# EAGLE schematic Impedance (EAGLE 9.6.2)
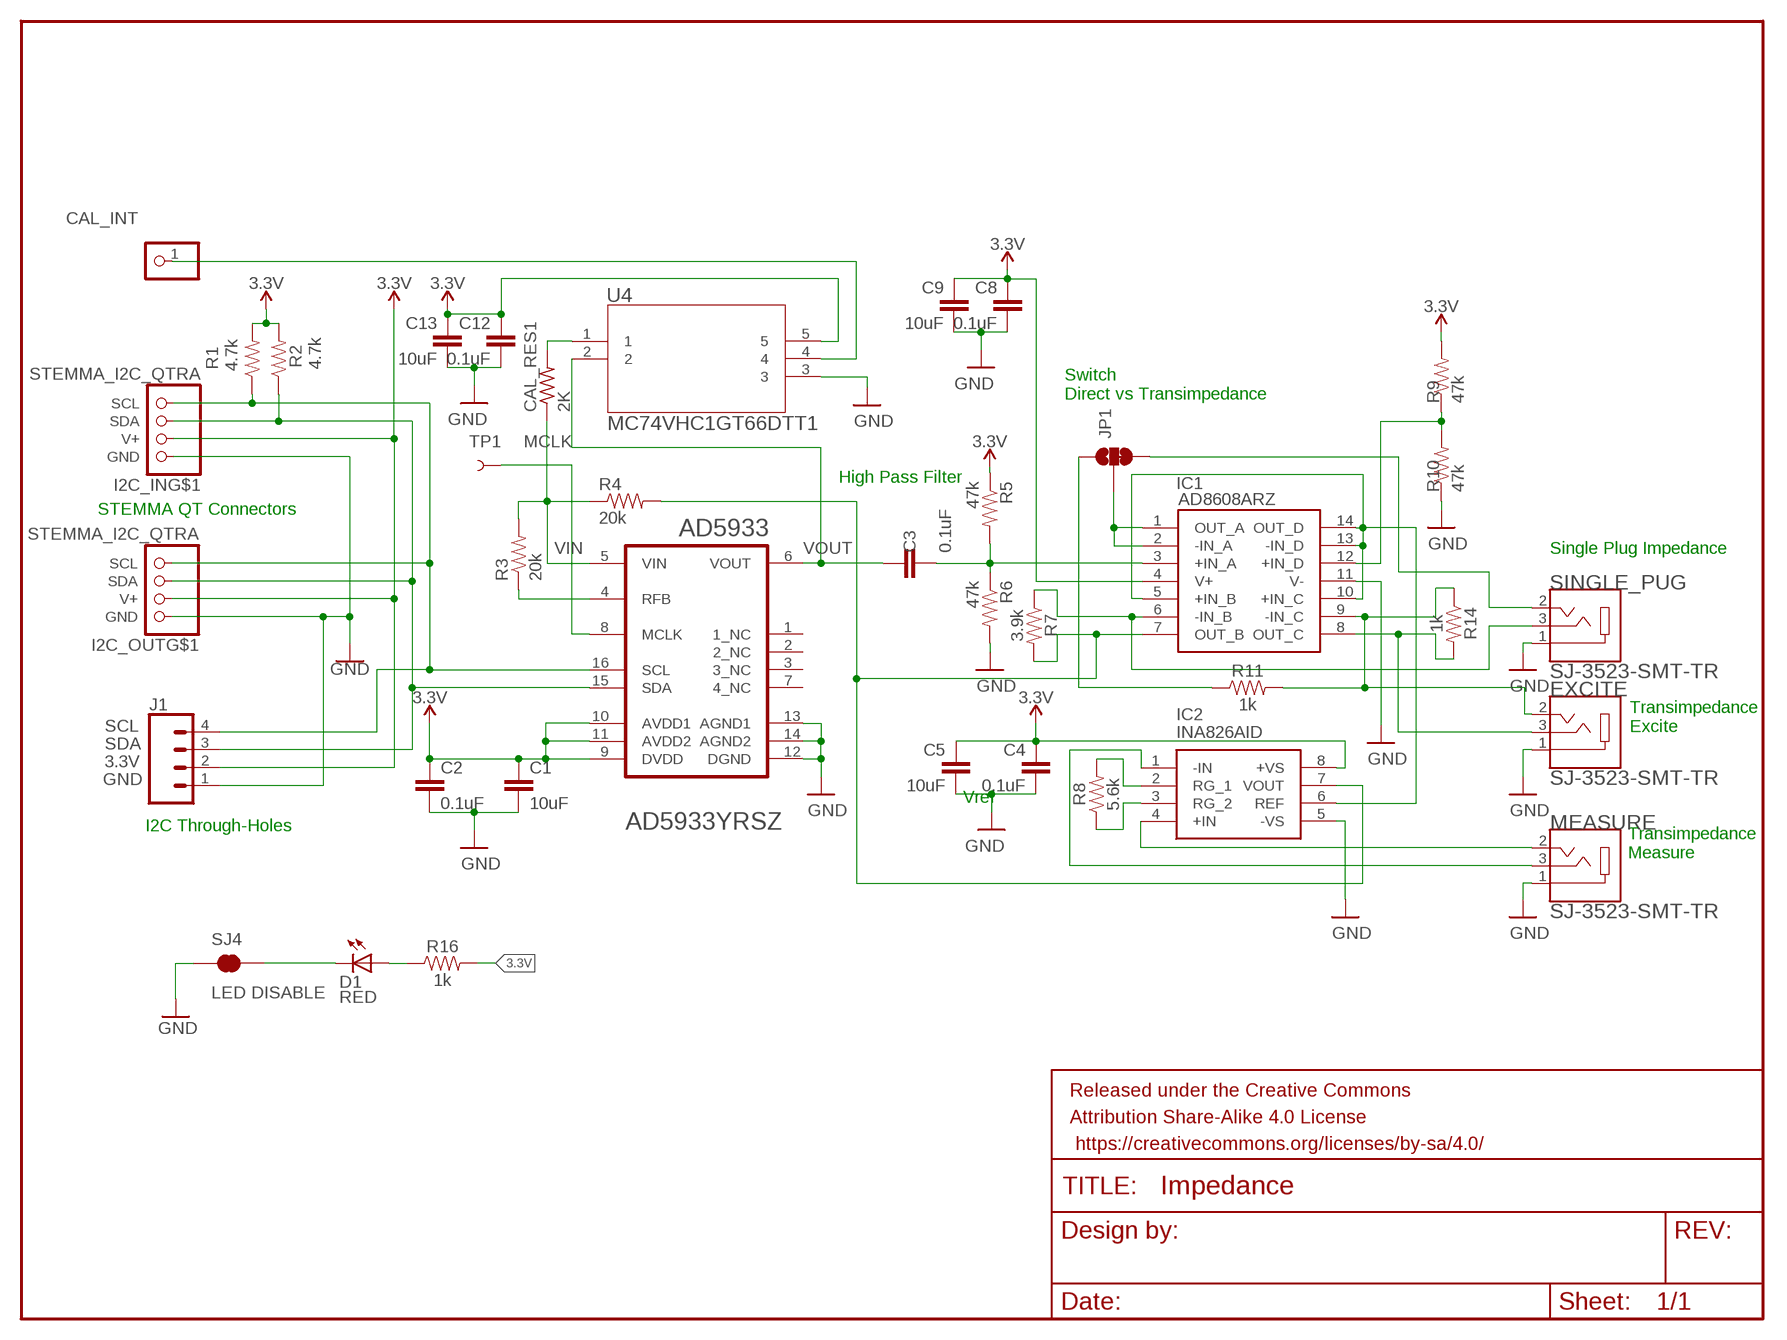
[diagram p0: schematic, sheet 1]

## Parts
AD5933  ANALOG_DEVICES_AD5933YRSZANALOG_DEVICES_AD5933YRSZ_0_0  [ANALOG_DEVICES_AD5933YRSZ_0]
C1  10uF  C-EUC0603  [C0603]
C2  0.1uF  C-EUC0603  [C0603]
C3  0.1uF  0.1UF-0603-25V-(+80/-20%)  [0603]
C4  0.1uF  C-EUC0603  [C0603]
C5  10uF  C-EUC0603  [C0603]
C8  0.1uF  C-EUC0603  [C0603]
C9  10uF  C-EUC0603  [C0603]
C12  0.1uF  C-EUC0603  [C0603]
C13  10uF  C-EUC0603  [C0603]
CAL_INT  PINHD-1X1  [1X01]
CAL_RES1  2K  R-US_R0603  [R0603]
D1  RED  LED-RED0603  [LED-0603]
EXCITE  SJ-3523-SMT-TR  [CUI_SJ-3523-SMT-TR]
FRAME1  FRAME-LETTERNO_PACKAGE  [DUMMY]
I2C_IN  STEMMA_I2C_QTRA  [JST_SH4_RA]
I2C_OUT  STEMMA_I2C_QTRA  [JST_SH4_RA]
IC1  AD8608ARZ  [SOIC127P600X175-14N]
IC2  INA826AID  [SOIC127P600X175-8N]
J1  CONN_04  [1X04]
JP1  JUMPER-SMT_3_1-NC_TRACE_NO-SILK  [SMT-JUMPER_3_1-NC_TRACE_NO-SILK]
MEASURE  SJ-3523-SMT-TR  [CUI_SJ-3523-SMT-TR]
R1  4.7k  4.7KOHM-0603-1/10W-1%  [0603]
R2  4.7k  4.7KOHM-0603-1/10W-1%  [0603]
R3  20k  20KOHM-0603-1/10W-1%  [0603]
R4  20k  20KOHM-0603-1/10W-1%  [0603]
R5  47k  47KOHM-0603-1/10W-1%  [0603]
R6  47k  47KOHM-0603-1/10W-1%  [0603]
R7  3.9k  3.9KOHM-0603-1/10W-1%  [0603]
R8  5.6k  5.6KOHM-0603-1/10W-1%  [0603]
R9  47k  47KOHM-0603-1/10W-1%  [0603]
R10  47k  47KOHM-0603-1/10W-1%  [0603]
R11  1k  1KOHM-0603-1/10W-1%  [0603]
R14  1k  1KOHM-0603-1/10W-1%  [0603]
R16  1k  1KOHM-0603-1/10W-1%  [0603]
SINGLE_PUG  SJ-3523-SMT-TR  [CUI_SJ-3523-SMT-TR]
SJ4  LED DISABLE  JUMPER-SMT_2_NC_TRACE_NO-SILK  [SMT-JUMPER_2_NC_TRACE_NO-SILK]
TP1  TEST-POINT3X5  [PAD.03X.05]
U4  MC74VHC1GT66DTT1  [TSOP5_1P65X3P15_ONS]

## Nets
3.3V: AD5933.9(DVDD) AD5933.10(AVDD1) AD5933.11(AVDD2) C1.1 C2.1 C4.1 C5.1 C8.1 C9.1 C12.1 C13.1 I2C_IN.2(V+) I2C_OUT.2(V+) IC1.4(V+) IC2.8(+VS) J1.2 R1.2 R2.2 R5.1 R9.2 R16.2 U4.5
GND: AD5933.12(DGND) AD5933.13(AGND1) AD5933.14(AGND2) C1.2 C2.2 C4.2 C5.2 C8.2 C9.2 C12.2 C13.2 EXCITE.1 I2C_IN.1(GND) I2C_OUT.1(GND) IC1.11(V-) IC2.5(-VS) J1.1 MEASURE.1 R6.2 R10.1 SINGLE_PUG.1 SJ4.1 U4.3
MCLK: AD5933.8(MCLK) TP1.P$1
N$1: IC1.6(-IN_B) R7.1 SINGLE_PUG.3
N$2: CAL_INT.1 U4.4
N$5: AD5933.4(RFB) R3.1
N$6: C3.2 IC1.3(+IN_A) R5.2 R6.1
N$8: JP1.1 R11.1
N$9: IC1.1(OUT_A) IC1.2(-IN_A) JP1.2
N$13: IC1.7(OUT_B) IC2.7(VOUT) R4.2 R7.2
N$14: IC1.12(+IN_D) R9.1 R10.2
N$15: JP1.3 SINGLE_PUG.2
N$18: IC1.5(+IN_B) IC1.10(+IN_C) IC1.13(-IN_D) IC1.14(OUT_D) IC2.6(REF)
N$19: EXCITE.2 IC1.9(-IN_C) R11.2 R14.1
N$20: IC2.4(+IN) MEASURE.2
N$21: IC2.1(-IN) MEASURE.3
N$22: IC2.2(RG_1) R8.2
N$23: IC2.3(RG_2) R8.1
N$24: CAL_RES1.2 U4.1
N$25: EXCITE.3 IC1.8(OUT_C) R14.2
N$26: D1.A R16.1
N$28: D1.C SJ4.2
SCL: AD5933.16(SCL) I2C_IN.4(SCL) I2C_OUT.4(SCL) J1.4 R1.1
SDA: AD5933.15(SDA) I2C_IN.3(SDA) I2C_OUT.3(SDA) J1.3 R2.1
VIN: AD5933.5(VIN) CAL_RES1.1 R3.2 R4.1
VOUT: AD5933.6(VOUT) C3.1 U4.2
Unconnected: AD5933.1(1_NC) AD5933.2(2_NC) AD5933.3(3_NC) AD5933.7(4_NC) I2C_IN.MT1(MT) I2C_IN.MT2(MT) I2C_OUT.MT1(MT) I2C_OUT.MT2(MT)

## Notes on the sheet
- Switch 
  Direct vs Transimpedance
- High Pass Filter
- STEMMA QT Connectors
- Single Plug Impedance
- Transimpedance
  Excite
- Vref
- I2C Through-Holes
- Transimpedance
  Measure

## Library data of the parts
AD5933 = Analog Devices - AD5933YRSZ:ANALOG_DEVICES_AD5933YRSZ: ADI-AD5933-RS-16; CIIVA_IDS: 19299999; CODE__JEDEC: MO-150-AC; COMPONENT_LINK_1_DESCRIPTION: Manufacturer URL; COMPONENT_LINK_1_URL: www.analog.com; COMPONENT_LINK_3_DESCRIPTION: Package Specification; COMPONENT_LINK_3_URL: http://www.analog.com/static/imported-files/packages/31572257652246RS_16.pdf; DATASHEET: http://www.analog.com/static/imported-files/data_sheets/AD5933.pdf; DATASHEET_VERSION: Rev. D; FOOTPRINT_VARIANT_NAME_0: Level C; FOOTPRINT_VARIANT_NAME_1: Level B; FOOTPRINT_VARIANT_NAME_2: Level A; IMPORTED: yes; IMPORTED_FROM: vault; IMPORT_TS: 1521848033; IO_INTERFACE: Serial; I_SUPPLY_TOTAL_MAX: 15mA; MASTER_FCLK: 16.776MHz; MF: Analog Devices; MPN: AD5933YRSZ; PACKAGE: RS-16; PACKAGE_DESCRIPTION: 16-Lead Shrink Small Outline Package [SSOP]; PACKAGE_VERSION: 3/17/2005; PIN_0_0_15_INSIDE_EDGE: clock; PIN_0_0_7_INSIDE_EDGE: clock; PREFIX: U; RELEASE_DATE: 1333437714; RESOLUTION_BITS: 12bit; TUNING_WORD_WIDTH_BITS: 27bit; VAULT_GUID: 12E548FF-7E75-4596-9B3A-06B167E4919E; VAULT_REVISION: 0B288880-7FBC-46A2-8187-17CED40A7223
C1 C2 C4 C5 C8 C9 C12 C13 = rcl:C-EU: CAPACITOR, European symbol; SPICEPREFIX: C
C3 = SparkFun-Capacitors:0.1UF: 0.1µF ceramic capacitors A capacitor is a passive two-terminal electrical component used to store electrical energy temporarily in an electric field.; PROD_ID: CAP-00810
CAL_INT = pinhead:PINHD-1X1: PIN HEADER
CAL_RES1 = rcl:R-US_: RESISTOR, American symbol; SPICEPREFIX: R
D1 = SparkFun-LED:LED-RED: Assorted Red LEDs LilyPad 1206- DIO-09912 1206- DIO-00809 0603- DIO-00819; PROD_ID: DIO-00819
EXCITE MEASURE SINGLE_PUG = SJ-3523-SMT-TR:SJ-3523-SMT-TR: Audio Jack Connector 3.5 mm Low Profile Surface Mount Stereo Jack, 3 Pin Right-Angle Check availability <https://pricing.snapeda.com/parts/SJ-3523-SMT-TR/CUI%20Devices/view-part?ref=eda>; AVAILABILITY: In Stock; CUI_PURCHASE_URL: https://www.cuidevices.com/product/interconnect/connectors/audio-connectors/jacks/sj-352x-smt-series?utm_source=snapeda.com&utm_medium=referral&utm_campaign=snapedaBOM; DESCRIPTION: 3.5 mm, Stereo, Right Angle, Surface Mount (SMT), 3 Conductors, 0~1 Internal Switches, Audio Jack Connector; MF: CUI Devices; MP: SJ-3523-SMT-TR; PACKAGE: None; PRICE: None; PURCHASE-URL: https://pricing.snapeda.com/search/part/SJ-3523-SMT-TR/?ref=eda
FRAME1 = SparkFun-Aesthetics:FRAME-LETTER: Schematic Frame - Letter Standard 8.5x11 US Letter frame; DESIGNER: Nobody; VERSION: v01
I2C_IN I2C_OUT = adafruit_electromech:STEMMA_I2C; LCSC: C145961
IC1 = AD8608ARZ:AD8608ARZ: Precision Amplifiers Low Noise CMOS RRIO Prec Quad Source: Datasheet <https://componentsearchengine.com/Datasheets/1/AD8608ARZ.pdf>; DESCRIPTION: Precision Amplifiers Low Noise CMOS RRIO Prec Quad; HEIGHT: 1.75mm; MANUFACTURER_NAME: Analog Devices; MANUFACTURER_PART_NUMBER: AD8608ARZ; MOUSER_PART_NUMBER: 584-AD8608ARZ; MOUSER_PRICE-STOCK: https://www.mouser.co.uk/ProductDetail/Analog-Devices/AD8608ARZ?qs=%2FtpEQrCGXCxN7b5tuN73yg%3D%3D
IC2 = INA826AID:INA826AID: Texas Instruments INA826AID Instrumentation Amplifier, 150uV Offset 1MHz GBW, CMMR 80dB, 2.7 36 V, 8-Pin SOIC Source: Datasheet <http://www.ti.com/lit/gpn/ina826>; DESCRIPTION: Texas Instruments INA826AID Instrumentation Amplifier, 150uV Offset 1MHz GBW, CMMR 80dB, 2.7 36 V, 8-Pin SOIC; HEIGHT: 1.75mm; MANUFACTURER_NAME: Texas Instruments; MANUFACTURER_PART_NUMBER: INA826AID; MOUSER_PART_NUMBER: 595-INA826AID; MOUSER_PRICE-STOCK: https://www.mouser.co.uk/ProductDetail/Texas-Instruments/INA826AID?qs=RqytGdBYyUH0CDtkCzl1iw%3D%3D
J1 = SparkFun-Connectors:CONN_04: Multi connection point. Often used as Generic Header-pin footprint for 0.1 inch spaced/style header connections On any of the 0.1 inch spaced packages, you can populate with these: Break Away Headers - Straight <https://www.sparkfun.com/products/116> (PRT-00116) Break Away Male Headers - Right Angle <https://www.sparkfun.com/products/553> (PRT-00553) Female Headers <https://www.sparkfun.com/products/115> (PRT-00115) Break Away Headers - Machine Pin <https://www.sparkfun.com/products/117> (PRT-00117) Break Away Female Headers - Swiss Machine Pin <https://www.sparkfun.com/products/743> (PRT-00743) For SCREWTERMINALS and SPRING TERMINALS visit here: Screw Terimnals on SparkFun.com <https://www.sparkfun.com/search/results?term=Screw+Terminals> (5mm/3.5mm/2.54mm spacing) This device is also useful as a general connection point to wire up your design to another part of your project. Our various solder wires solder well into these plated through hole pads. Hook-Up Wire - Assortment (Stranded, 22 AWG) <https://www.sparkfun.com/products/11375> (PRT-11375) Hook-Up Wire - Assortment (Solid Core, 22 AWG) <https://www.sparkfun.com/products/11367> (PRT-11367) View the entire wire category on our website here <https://www.sparkfun.com/categories/141> Special notes: Molex polarized connector foot print use with SKU : PRT-08231 with associated crimp pins and housings. 1MM SMD Version SKU: PRT-10208; PROD_ID: CONN-09696
JP1 = SparkFun-Jumpers:JUMPER-SMT_3_1-NC_TRACE: Normally closed trace jumper (1 of 2 connections) This jumper has a trace between two pads so it's normally closed (NC). The other connection is normally open (NO). Use a razor knife to open the connection. For best results follow the IPC guidelines for cutting traces: Cutout at least 0.063 mm (0.005 in). Remove all loose material to clean up the cut area. Seal the cut with an approved epoxy. Reapply solder to reclose the connection, or to close the NO connection.
R1 R2 = SparkFun-Resistors:4.7KOHM: 4.7kΩ resistor A resistor is a passive two-terminal electrical component that implements electrical resistance as a circuit element. Resistors act to reduce current flow, and, at the same time, act to lower voltage levels within circuits. - Wikipedia; PROD_ID: RES-07857
R3 R4 = SparkFun-Resistors:20KOHM: 20kΩ resistor A resistor is a passive two-terminal electrical component that implements electrical resistance as a circuit element. Resistors act to reduce current flow, and, at the same time, act to lower voltage levels within circuits. - Wikipedia; PROD_ID: RES-09383
R5 R6 R9 R10 = SparkFun-Resistors:47KOHM: 47kΩ resistor A resistor is a passive two-terminal electrical component that implements electrical resistance as a circuit element. Resistors act to reduce current flow, and, at the same time, act to lower voltage levels within circuits. - Wikipedia; PROD_ID: RES-07871
R7 = SparkFun-Resistors:3.9KOHM: 3.9kΩ resistor A resistor is a passive two-terminal electrical component that implements electrical resistance as a circuit element. Resistors act to reduce current flow, and, at the same time, act to lower voltage levels within circuits. - Wikipedia; PROD_ID: RES-08701
R8 = SparkFun-Resistors:5.6KOHM: 5.6kΩ resistor A resistor is a passive two-terminal electrical component that implements electrical resistance as a circuit element. Resistors act to reduce current flow, and, at the same time, act to lower voltage levels within circuits. - Wikipedia; PROD_ID: RES-12378
R11 R14 R16 = SparkFun-Resistors:1KOHM: 1kΩ resistor A resistor is a passive two-terminal electrical component that implements electrical resistance as a circuit element. Resistors act to reduce current flow, and, at the same time, act to lower voltage levels within circuits. - Wikipedia; PROD_ID: RES-07856
SJ4 = SparkFun-Jumpers:JUMPER-SMT_2_NC_TRACE: Normally closed trace jumper This jumper has a trace between two pads so it's normally closed (NC). Use a razor knife to open the connection. For best results follow the IPC guidelines for cutting traces: Cutout at least 0.063 mm (0.005 in). Remove all loose material to clean up the cut area. Seal the cut with an approved epoxy. Reapply solder to reclose the connection.
TP1 = SparkFun-Connectors:TEST-POINT: SparkFun Test Points Bare copper test points for troubleshooting or In-Circuit-Testing. These are used by our Production team for verifying production board runs using pogo-pins on test beds. SparkFun Products: SparkFun LSM9DS1 Breakout <https://www.sparkfun.com/products/13284> SparkFun PSOC <https://www.sparkfun.com/products/13714> SparkFun Load Cell Amplifier <https://www.sparkfun.com/products/13879>
U4 = MC74VHC1GT66DTT1:MC74VHC1GT66DTT1; COPYRIGHT: Copyright (C) 2024 Ultra Librarian. All rights reserved.; MANUFACTURER_PART_NUMBER: MC74VHC1GT66DTT1; MFR_NAME: onsemi